# Altium schematic sheet Schematic.SchDoc
size A3
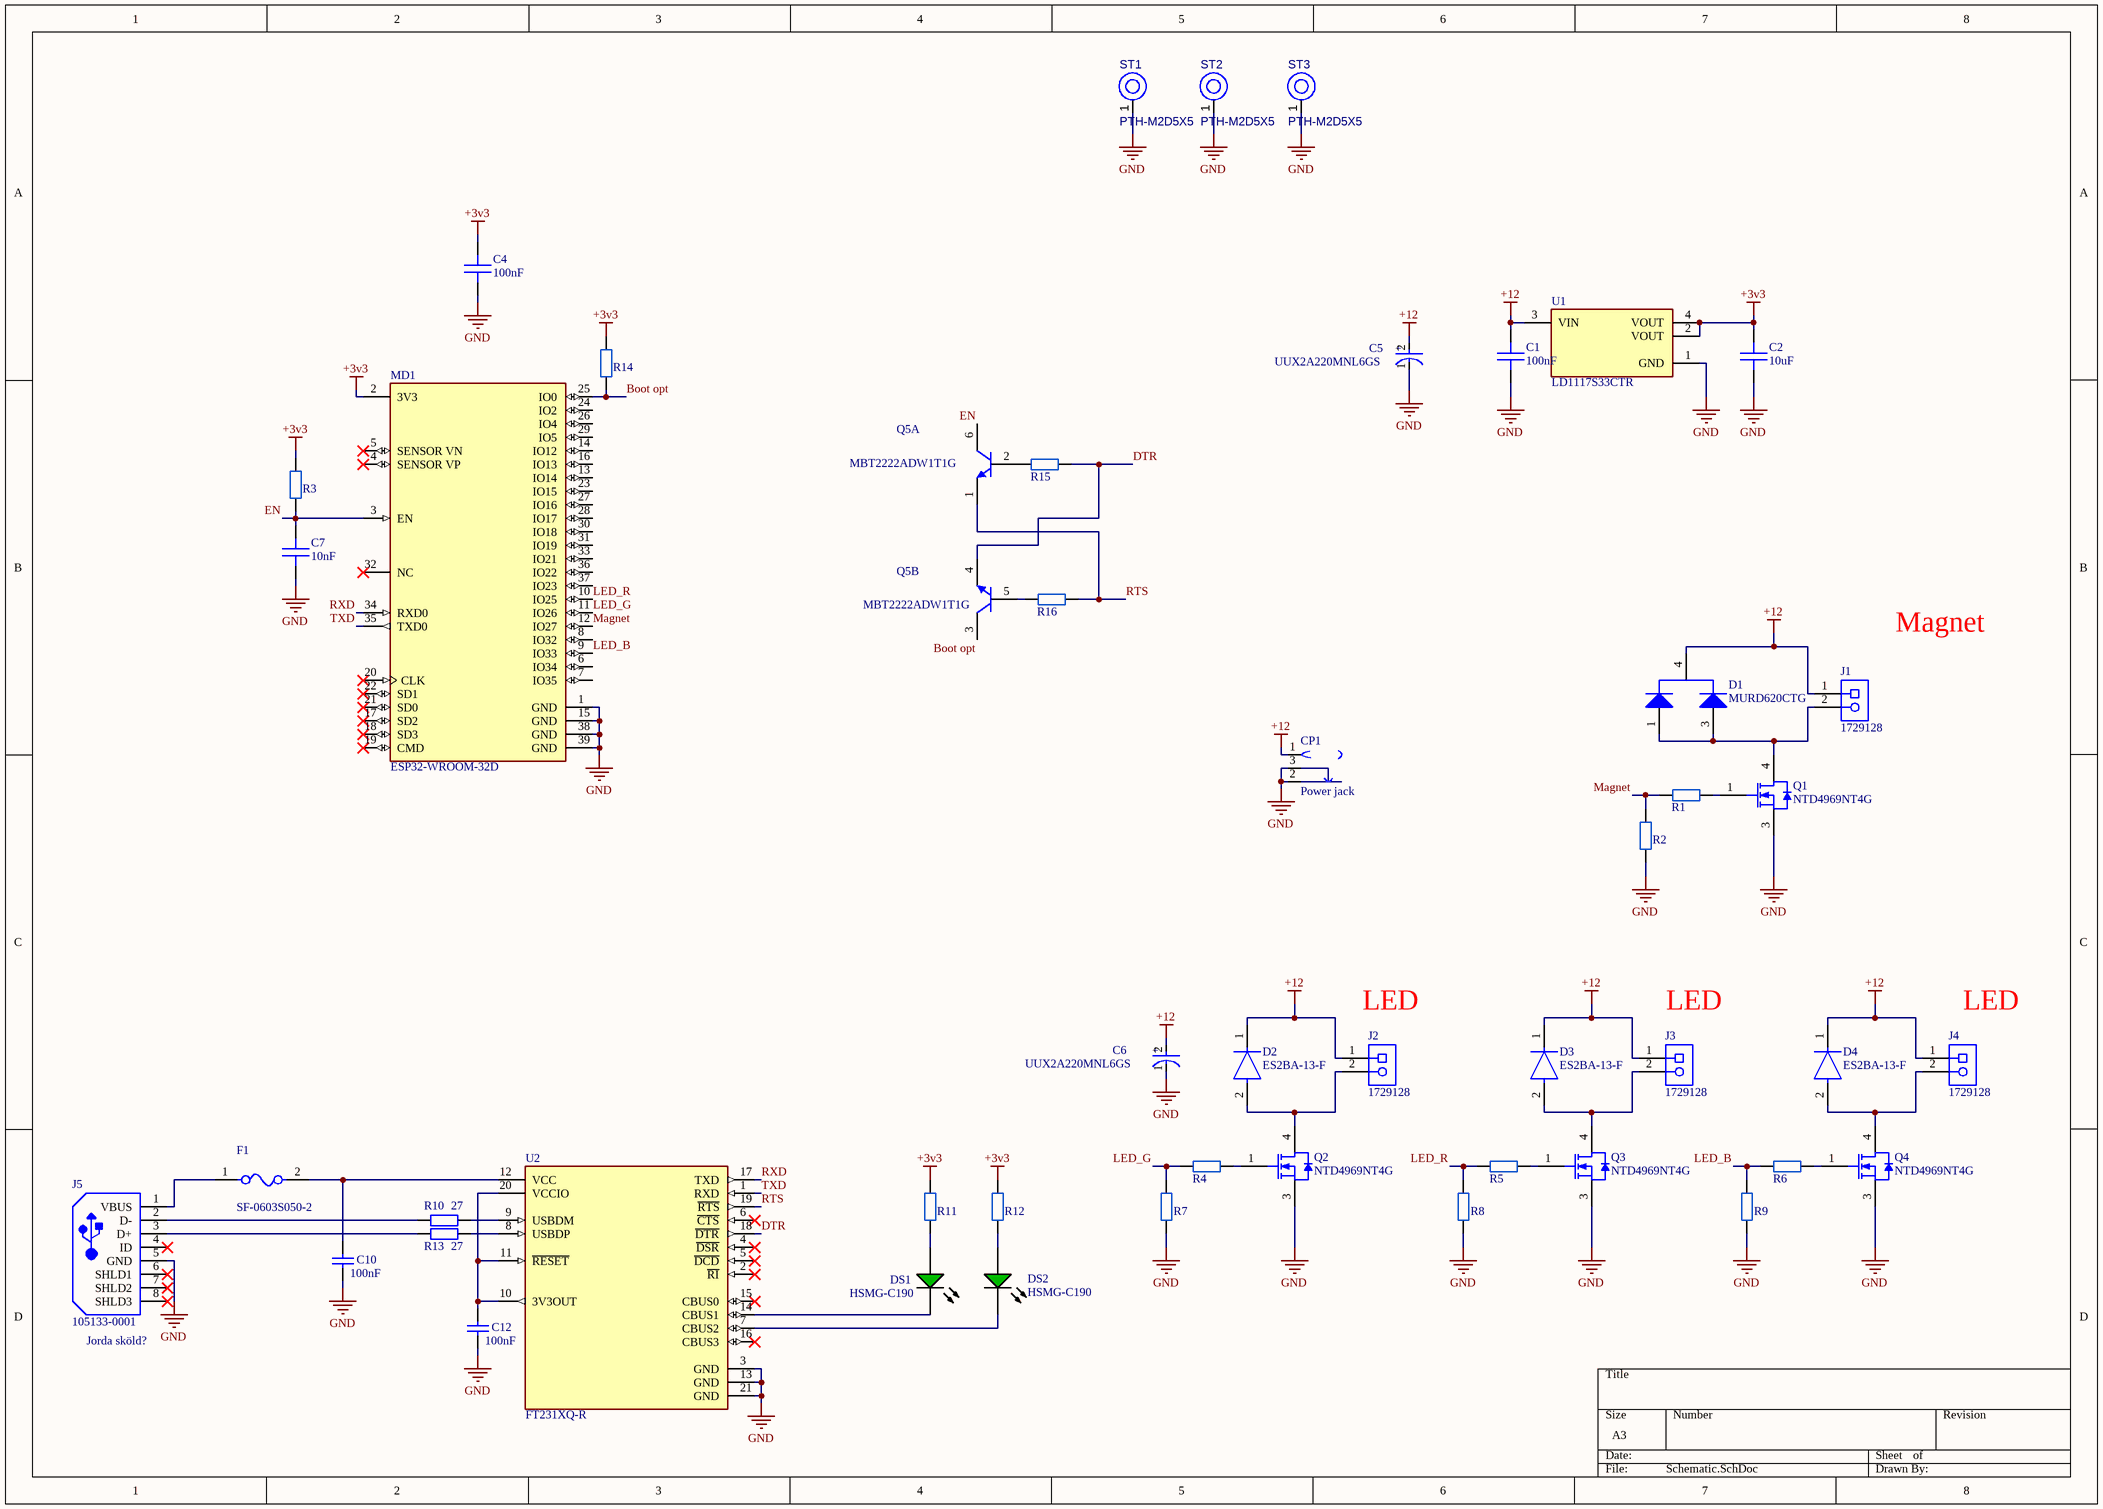
[diagram p0: Schematic.SchDoc]

## Parts
C1  value 100nF  [C0603 (1608)]  (hidden comment: Cap SMD)
C2  value 10uF  [C0603 (1608)]  (hidden comment: Cap SMD)
C4  value 100nF  [C0603 (1608)]  (hidden comment: Cap SMD)
C5  UUX2A220MNL6GS  [FP-UUX2A220MNL6GS-MFG]
C6  UUX2A220MNL6GS  [FP-UUX2A220MNL6GS-MFG]
C7  value 10nF  [C0603 (1608)]  (hidden comment: Cap SMD)
C10  100nF  [C0603 (1608)]
C12  100nF  [C0603 (1608)]
CP1  Power jack  [CLIFF SMD KLD-0202 BARRELL JACK DC CONNECTOR 2.1mm]
D1  MURD620CTG  [ONSC-DPAK-3-369C-01_V]
D2  ES2BA-13-F  [FP-SMA-MFG]
D3  ES2BA-13-F  [FP-SMA-MFG]
D4  ES2BA-13-F  [FP-SMA-MFG]
DS1  HSMG-C190  [AVAG-HSMX-C190_V]
DS2  HSMG-C190  [AVAG-HSMX-C190_V]
F1  SF-0603S050-2  [FP-SF-0603S-MFG]
J1  1729128  [PHOE-1729128-2_V]
J2  1729128  [PHOE-1729128-2_V]
J3  1729128  [PHOE-1729128-2_V]
J4  1729128  [PHOE-1729128-2_V]
J5  105133-0001  [MOLX-105133-0001_V]
MD1  ESP32-WROOM-32D  [FP-ESP32-WROOM-32D-MFG]
Q1  NTD4969NT4G  [ONSC-DPAK-3-369AA-01_V]
Q2  NTD4969NT4G  [ONSC-DPAK-3-369AA-01_V]
Q3  NTD4969NT4G  [ONSC-DPAK-3-369AA-01_V]
Q4  NTD4969NT4G  [ONSC-DPAK-3-369AA-01_V]
Q5  MBT2222ADW1T1G  [ONSC-SOT-363-6-419B-02_V]  (parts A,B of 2)
R1  Res  [R0603 (1608)]  (value not drawn)
R2  Res  [R0603 (1608)]  (value not drawn)
R3  Res  [R0603 (1608)]  (value not drawn)
R4  Res  [R0603 (1608)]  (value not drawn)
R5  Res  [R0603 (1608)]  (value not drawn)
R6  Res  [R0603 (1608)]  (value not drawn)
R7  Res  [R0603 (1608)]  (value not drawn)
R8  Res  [R0603 (1608)]  (value not drawn)
R9  Res  [R0603 (1608)]  (value not drawn)
R10  27  [R0603 (1608)]
R11  Res  [R0603 (1608)]  (value not drawn)
R12  Res  [R0603 (1608)]  (value not drawn)
R13  27  [R0603 (1608)]
R14  Res  [R0603 (1608)]  (value not drawn)
R15  Res  [R0603 (1608)]  (value not drawn)
R16  Res  [R0603 (1608)]  (value not drawn)
ST1  PTH-M2D5X5  [PTH-M2D5X5]
ST2  PTH-M2D5X5  [PTH-M2D5X5]
ST3  PTH-M2D5X5  [PTH-M2D5X5]
U1  LD1117S33CTR  [FP-SOT-223-0046067_14-MFG]
U2  FT231XQ-R  [FP-QFN-20-MFG]

## Nets
+3v3: C2.2 C4.2 MD1.2(3V3) R3.1 R11.2 R12.2 R14.1 U1.2(VOUT) U1.4(VOUT)
+12: C1.2 C5.2(A) C6.2(A) CP1.1 D1.4(K) D2.1(C) D3.1(C) D4.1(C) J1.1 J2.1 J3.1 J4.1 U1.3(VIN)
GND: C1.1 C2.1 C4.1 C5.1(C) C6.1(C) C7.1 C10.1 C12.1 CP1.2 CP1.3 J5.5(GND) MD1.1(GND) MD1.15(GND) MD1.38(GND) MD1.39(GND) Q1.3(S) Q2.3(S) Q3.3(S) Q4.3(S) R2.1 R7.1 R8.2 R9.1 ST1.1(H1) ST2.1(H1) ST3.1(H1) U1.1(GND) U2.3(GND) U2.13(GND) U2.21(GND)
Boot opt: MD1.25(IO0) Q5.3(C) R14.2
DTR: Q5.4(E) R15.2 U2.18(~{DTR})
EN: C7.2 MD1.3(EN) Q5.6(C) R3.2
LED_B: MD1.9(IO33) R6.2 R9.2
LED_G: MD1.11(IO26) R4.2 R7.2
LED_R: MD1.10(IO25) R5.2 R8.1
Magnet: MD1.12(IO27) R1.2 R2.2
RTS: Q5.1(E) R16.2 U2.19(~{RTS})
RXD: MD1.34(RXD0) U2.17(TXD)
TXD: MD1.35(TXD0) U2.1(RXD)
NetC10_2: C10.2 F1.2 U2.12(VCC)
NetC12_2: C12.2 U2.10(3V3OUT) U2.11(~{RESET}) U2.20(VCCIO)
NetD1_1: D1.1(A1) D1.3(A2) J1.2 Q1.4(D)
NetD2_2: D2.2(A) J2.2 Q2.4(D)
NetD3_2: D3.2(A) J3.2 Q3.4(D)
NetD4_2: D4.2(A) J4.2 Q4.4(D)
NetDS1_1: DS1.1(A) R11.1
NetDS1_2: DS1.2(K) U2.14(CBUS1)
NetDS2_1: DS2.1(A) R12.1
NetDS2_2: DS2.2(K) U2.7(CBUS2)
NetF1_1: F1.1 J5.1(VBUS)
NetJ5_2: J5.2(D-) R10.1
NetJ5_3: J5.3(D+) R13.1
NetQ1_1: Q1.1(G) R1.1
NetQ2_1: Q2.1(G) R4.1
NetQ3_1: Q3.1(G) R5.1
NetQ4_1: Q4.1(G) R6.1
NetQ5_2: Q5.2(B) R15.1
NetQ5_5: Q5.5(B) R16.1
NetR10_2: R10.2 U2.9(USBDM)
NetR13_2: R13.2 U2.8(USBDP)

Not connected (* = marked no-connect by the designer): J5 4(ID)* 6(SHLD1)* 7(SHLD2)* 8(SHLD3)*; MD1 4(SENSOR_VP)* 5(SENSOR_VN)* 6(IO34) 7(IO35) 8(IO32) 13(IO14) 14(IO12) 16(IO13) 17(SD2)* 18(SD3)* 19(CMD)* 20(CLK)* 21(SD0)* 22(SD1)* 23(IO15) 24(IO2) 26(IO4) 27(IO16) 28(IO17) 29(IO5) 30(IO18) 31(IO19) 32(NC)* 33(IO21) 36(IO22) 37(IO23); U2 2(~{RI})* 4(~{DSR})* 5(~{DCD})* 6(~{CTS})* 15(CBUS0)* 16(CBUS3)*

## Notes on the sheet
- Magnet
- (near J2) LED
- (near J3) LED
- (near J4) LED
- (near J5) Jorda sköld?
- (in symbol CMP-12462-000025-1) +

## Library data of the parts
C5 C6 = CMP-12462-000025-1: CAP ALUM 22UF 20% 100V SMD; Dissipation Factor: 0.08%; Life (Hours): 2000Hour; Ripple Current: 121mA; Leakage Current: 105uA; Diameter: 8mm; Height - Seated (Max): 0.413inch; Package Quantity: 1; Termination: SMD/SMT; Min Operating Temperature: -55°C; Lead Free: Lead Free; Tolerance: 20%; Case/Package: Radial; Packaging: Tape and Reel; Length: 10mm; Voltage Rating (DC): 100V; Features: General Purpose; Capacitance: 22uF; Lead Pitch: 3.1mm; Radiation Hardening: No; Max Operating Temperature: 105°C; Voltage Rating: 100V; Height: 10mm; Mount: Surface Mount
C10 C12 = Cap: Capacitor; Published: 8-Jun-2000; LatestRevisionDate: 17-Jul-2002; LatestRevisionNote: Re-released for DXP Platform.; PackageReference: RAD-0.3; Publisher: Altium Limited; PackageDescription: Radial Cap, Thru-Hole; 2 Leads; 0.3 in Pin Spacing; Value: 100nF
CP1 = Barrel jack KLD-0202: Surface mounted DC barrell jack, KLD-0202 design
D1 = CMP-0902-00255-1: SWITCHMODE(TM) Power Rectifier, 3-Pin DPAK, Pb-Free, Tube; Manufacturer: On Semiconductor; VRRM Max (V): 200; Type: Ultrafast; IFSM Max (A): 50; Packing: Tube; RoHS: TRUE; Mounting Technology: Surface Mount; DatasheetVersion: Rev. 11; PackageVersion: Rev. E, 02/2014; PackageDescription: 3-Pin Flange Mount, Body 6.54 x 6.095 mm, Pitch 2.29 mm; PartNumber: MURD620CTG; ComponentLink2URL: http://www.onsemi.cn/pub_link/Collateral/MURD620CT-D.PDF; PackageReference: DPAK-3-369C-01; ComponentLink1Description: Manufacturer URL; ComponentLink1URL: http://www.onsemi.com/; ComponentLink3Description: Package Specification; ComponentLink2Description: Datasheet; ComponentLink3URL: http://www.onsemi.cn/pub_link/Collateral/369C.PDF
D2-D4 = CMP-12791-000037-1: DIODE GEN PURP 100V 2A SMA; Manufacturer: Diodes Inc.; Standoff Height: 0.05mm; Value: 25pF; Peak Reverse Current: 5uA; Max Junction Temp: +150°C; Max Surge Forward Current: 50A; Digikey Description: DIODE GEN PURP 100V 2A SMA; Max Repetitive Reverse Voltage: 100V; Mouser Description: ES2BA Series 100 V 2 A Surface Mount Super-Fast Rectifier - DO-214AC; RoHS: TRUE; Device Class L3: Rectifier Diodes; Height: 2.4mm; Footprint Url: https://www.diodes.com/assets/Package-Files/SMA.pdf; Lead Free: Yes; Device Class L1: Discrete Semiconductors; Forward Current: 2A; ComponentLink2Description: Datasheet; Manufacturer Part Number: ES2BA-13-F; Temperature: -55°C to +150°C; Temperature Range Low: -55°C; Automotive: No; Device Class L2: Diodes; Category: Diode; Octopart: https://octopart.com/es2ba-13-f-diodes+inc.-14402013; Package: SMA; Capacitance: 25pF; ComponentLink2URL: https://www.diodes.com/assets/Datasheets/ds14002.pdf; Reverse Voltage: 100V; Temperature Range High: +150°C
DS1 DS2 = CMP-1744-00002-1: Chip LED, Green, 2.2 V, -40 to 85 degC, 2-Pin SMD, RoHS, Tape and Reel; Frequency: 400 KHz; Max Supply Voltage: 5.5 V; Access Time: 3500 ns; Clock Frequency: 100 KHz; Case\Package: SOIC; Density: 32 kb; Nominal Supply Current: 2 mA; Interface: Serial; Min Supply Voltage: 1.7 V; Packaging: Tape and Reel; PackageReference: HSMX-C190; ComponentLink2URL: http://docs.avagotech.com/docs/AV02-0551EN; RoHSCompliant: true; Pins: 8; REACH SVHC: No SVHC; Max Operating Temperature: 85 degC; Width: 4 mm; Radiation Hardening: No; Package Quantity: 3000; ComponentLink3Description: Package Specification; ComponentLink1Description: Manufacturer URL; Min Operating Temperature: -40 degC; PackageDescription: 2-Pin Surface Mount Device, Body 1.6 x 0.8 mm, Height 0.9 mm; Max Clock Frequency: 100 KHz; Height: 1.5 mm; ComponentLink1URL: http://www.avagotech.com/; DatasheetVersion: Mar-12; ComponentLink2Description: Datasheet; Mount: Surface Mount; Length: 5 mm; ComponentLink3URL: http://www.fairchildsemi.com/dwg/MA/MA03D.pdf
F1 = CMP-07399-000004-1: FUSE BOARD MNT 500MA 50VDC 0603; Manufacturer: Bourns Inc.; Fuse I2T: 0.009A2Sec; Fuse Current: 0.5A; Fuse Interrupt Ac Current: 50A; Max Fuse Ac Voltage: 35V; Resistance: 232mΩ; Fuse Blow Speed: Slow; Value: 232mΩ; Max Fuse Dc Voltage: 50V; Automotive: No; Category: Fuse; Temperature Range High: +105°C; Device Class L1: Circuit Protection; Height: 0.55mm; RoHS: TRUE; ComponentLink2URL: https://www.bourns.com/docs/product-datasheets/sf0603s.pdf; Ipc Land Pattern Name: CAPC16080X45; Temperature Range Low: -20°C; Mouser Description: Surface Mount Fuses 0.50A Slow Blow SinglFuse; Manufacturer Part Number: SF-0603S050-2; Package: SF-0603S; Device Class L3: unset; Digikey Description: FUSE BOARD MNT 500MA 50VDC 0603; Device Class L2: Fuses; Lead Free: Yes; Temperature: -20°C to +105°C; ComponentLink2Description: Datasheet; Octopart: https://octopart.com/sf-0603s050-2-bourns-10486821; Fuse Interrupt Dc Current: 50A
J1-J4 = CMP-2000-05815-1: PCB Terminal Block, 13.5 A, 400 V, 2-Pin THD, RoHS, Bulk; Manufacturer: Phoenix Contact; Package Version: 03/2015; No. of Rows: 1; Pitch: 5.08mm; No. of Positions: 2; Voltage Rating: 400V; Current Rating: 13500mA; Manufacturer URL: http://www.phoenixcontact.com/; Datasheet URL: https://datasheet.ciiva.com/16046/1729128-16046181.pdf; RoHS: TRUE; Package URL: https://www.phoenixcontact.com/online/portal/pi/pxc/product_detail_page/!ut/p/b1/3VdJjqNKFDxLH8AFycySyWY2ozFsEPOMMQaDOX1XedGL_1Vdm5YXJleknhSKeBkvI6EA8ncAo3AYoDhBQGco6KN7VURTdemj9us_IEKEZo_YHiPAEWEFmDGOHMORkqKYCORBZxgL7ZoaZYcbFFUZ3fqxSY6GOuxydWUuHqz1ynmMFygu583Bob0Ewr6Sd_l-5m-kAueHiB0jpRwZwe58wwtkpxtMYd_LmGcDRU02dRNEyWt6Y2ti5pSyJ_reIkzIulrqApdnbT11V5jnCKbYNCvhEM1MCpPByat_X379-iThf08CI5GfOPqfBeS3BRoBOdD55AKVv0iLwCMq-2BrzXWSGRH7pUGD9uwXQjiph3xL0DKQwdGa0JImiIOmBNOestqgwTHSSs2oOep-78apyXQBvNi8ZLaFjvjWvcaUEBu0MC6Wbe-d6mB0FAebo2lUWinqYaZs5DAYzV0RP9yitUjnGJ0iI9xhZkT42OCQNUJJhkgWINNQLP2JFP6OpMg3JCVg70jqHT0lvKOnhHf0lPuOnnLf0VPuWx6_dxwUIvwk5WMkT0kLL1mh61l2yZVSzG3pYV_bqo-mj6uMKwKwdnnW8Jh5RTOJzMOA5c-eJDaZQw4mTMPH02PvS_ZAqNVjVTo2WyYLkwH_KU1mmmG5kjRhDqPXLwwVHvVOjCM60-fpXvTDfMGW1PVFVS1r4e4yVDk4ZdNbkUHvqPqQSeian4UD39fNKmachqdJ1NJbyk8rXT9mXTvPk3oE5meulKGgiruPJek-4I9hTT6G8ZLOyRSm2RRVbThERQad5OS28hdt4YW4vG0stgYYzsWsK4_7y6DZMjJSCqri1kyiZR5vD7pwIrNR7QwPHTcLTI5qT7eRlpHrdGiupYlqQDJ7zy_CND8fWWBoLRXxk1RVcXiBQwbTD4Xi7KL-FuO94t9xaqweXzH; PartNumber: 1729128; Package Description: 2-Pin Through Hole Device, Body 8.1 x 10.16 mm, Pitch 5.08 mm; Datasheet Version: 12/2013; Mounting Technology: ThroughHole; Orientation: Horizontal; Package Reference: 1729128-2; Packing: Bulk
J5 = CMP-2000-05829-1: Micro-USB B Receptacle, Vertical, -30 to 85 degC, 5-Pin SMD, RoHS, Tape and Reel; Manufacturer: Molex; Package Version: Rev. C, 11/2015; Voltage Rating: 30VAC; Connector Type: MicroUSBTypeBReceptacle; Current Rating: 1.8A; Number of Ports: 1; Voltage - Max: 30V; Mounting Style: SMD/SMT; Packaging: Reel; Product: MicroUSBTypeBConnectors; Contact Plating: Gold; Flammability Rating: UL94V-0; Package Description: 5-Pin Surface Mount Device, Pitch 0.65 mm; Package Reference: 105133-0001; Contact Material: CopperAlloy; Mounting Angle: Vertical; RoHS: Details; Manufacturer URL: http://www.molex.com/; Factory Pack Quantity: 6000; PartNumber: 105133-0001; Standard: USB; Brand: Molex; Series: 105133; Product Category: USBConnectors; Termination Style: SolderTail; Gender: Receptacle; Package URL: http://www.molex.com/pdm_docs/sd/1051330001_sd.pdf; Datasheet Version: 03/2016; Color: Black; Datasheet URL: http://www.molex.com/webdocs/datasheets/pdf/en-us/1051330001_IO_CONNECTORS.pdf; Mounting Technology: SurfaceMount
MD1 = CMP-194065-000003-1: WIFI MODULE 32MBITS SPI FLASH; Manufacturer: Espressif Systems; Max Supply Voltage: 3.6V; Nominal Supply Current: 500mA; Max Frequency: 2484MHz; Number Of Adc Channels: 16; Number Of Gpio: 32; Interface: I2C,SPI,UART,Ethernet,I2S,Other; Data Rate: 150Mbits/s; Min Supply Voltage: 3V; Bandwidth: 72MHz; Sensitivity: -98dBm; Octopart: https://octopart.com/esp32-wroom-32d-espressif+systems-91040050; Package: ESP32-WROOM-32D; ComponentLink2URL: https://www.espressif.com/sites/default/files/documentation/esp32-wroom-32d_esp32-wroom-32u_datasheet_en.pdf; Lead Free: Yes; Category: UNK; Mouser Description: Wi-Fi/BT BLE Module ESP32-D0WD, SPI Flash, UART, P; Device Class L1: Integrated Circuits (ICs); RoHS: TRUE; Temperature Range Low: -40°C; ComponentLink2Description: Datasheet; Digikey Description: WIFI MODULE 32MBITS SPI FLASH; Height: 3.2mm; Temperature: -40°C to +85°C; Manufacturer Part Number: ESP32-WROOM-32D; Device Class L3: Transceivers; Device Class L2: RF Semiconductors and Devices; Temperature Range High: +85°C; Automotive: No
Q1-Q4 = CMP-1058-00344-1: Power MOSFET, 30 V, 41 A, Single N-Channel, 3-Pin DPAK, Pb-Free, Tape and Reel; Manufacturer: On Semiconductor; ID Max (A): 41; VGS(th) Max (V): 2.5; Qrr Typ (nC): 8; Ciss Typ (pF): 837; V(BR)DSS Min (V): 30; Coss Typ (pF): 347; VGS Max (V): 20; Crss Typ (pF): 180; Channel Polarity: N Channel; Packing: Tape and Reel; ComponentLink2URL: http://www.onsemi.cn/pub_link/Collateral/NTD4969N-D.PDF; ComponentLink3Description: Package Specification; ComponentLink1Description: Manufacturer URL; Configuration: Single; ComponentLink2Description: Datasheet; DatasheetVersion: Rev. 1; PartNumber: NTD4969NT4G; Mounting Technology: Surface Mount; ComponentLink3URL: http://www.onsemi.cn/pub_link/Collateral/369AA.PDF; PackageDescription: 3-Pin Flange Mount, Body 6.54 x 6.095 mm, Pitch 2.29 mm; Package Type: DPAK-3, IPAK-3; PackageReference: DPAK-3-369AA-01; PackageVersion: Rev. B, 06/2010; ComponentLink1URL: http://www.onsemi.com/; RoHS: Pb-Free
Q5 = CMP-1048-00839-1: General Purpose Transistor, NPN Silicon, 6-Pin SOT-363, Pb-Free, Tape and Reel; Manufacturer: On Semiconductor; Polarity: Dual NPN; fT Min (MHz): 300; IC Continuous (A): 0.6; PackageDescription: 6-Pin Small Outline Transistor, Body 2 x 1.25 mm, Pitch 0.65 mm; DatasheetVersion: Rev. 5; ComponentLink3URL: http://www.onsemi.cn/pub_link/Collateral/419B-02.PDF; RoHS: TRUE; ComponentLink2Description: Datasheet; ComponentLink3Description: Package Specification; ComponentLink2URL: http://www.onsemi.com/pub_link/Collateral/MBT2222ADW1T1-D.PDF; ComponentLink1URL: http://www.onsemi.com/; PartNumber: MBT2222ADW1T1G; Packing: Tape and Reel; Mounting Technology: Surface Mount; PackageReference: SOT-363-6-419B-02; ComponentLink1Description: Manufacturer URL; PackageVersion: Rev. Y, 12/2012
R1-R9 R11 R12 R14-R16 = Resistor EU
R10 R13 = Res2: Resistor; Published: 8-Jun-2000; LatestRevisionDate: 17-Jul-2002; LatestRevisionNote: Re-released for DXP Platform.; PackageReference: AXIAL-0.4; Publisher: Altium Limited; PackageDescription: Axial Device, Thru-Hole; 2 Leads; 0.4 in Pin Spacing; Value: 27
ST1-ST3 = CMP-00028-00004-1: M2 PTH (2.5mm), 5mm pad; Pins: 1
U1 = CMP-0244-00307-2: IC REG LINEAR 3.3V 800MA SOT223; Input Bias Current: 5mA; Output Voltage Accuracy: 1%; Dropout Voltage: 1.1V; Power Dissipation: 12W; Polarity: Positive; Min Input Voltage: 5.3V; Quiescent Current: 10mA; Max Output Current: 1.3A; Output Current: 950mA; Number of Regulators: 1; Max Supply Voltage: 15V; Output Type: Fixed; Output Voltage: 3.3V; Number of Terminals: 4; Min Supply Voltage: 3.3V; Termination: SMD/SMT; Mount: Surface Mount; Max Power Dissipation: 12W; Case/Package: SOT-223; Lead Free: Lead Free; Height: 1.8mm; REACH SVHC: No SVHC; Radiation Hardening: No; Width: 3.5mm; Length: 6.5mm; Packaging: Tape and Reel; Max Input Voltage: 15V; Accuracy: 1%; Weight: 0.01lb; Contact Plating: Tin; Max Operating Temperature: 125°C; Number of Pins: 4; Max Output Voltage: 3.3V; Min Operating Temperature: -40°C; Nominal Output Voltage: 3.3V; Package Quantity: 1; Min Output Voltage: 3.3V; Number of Outputs: 1
U2 = CMP-0248-00001-3: IC USB SERIAL FULL UART 20QFN; Data Rate: 12Mbps; Operating Supply Current: 8mA; Min Supply Voltage: 2.97V; Max Supply Voltage: 5.5V; Number of Channels: 1; Min Operating Temperature: -40°C; Case/Package: QFN; Mount: Surface Mount; Number of Pins: 20; Interface: UART; Lead Free: Lead Free; Package Quantity: 5000; Weight: 0.004339oz; Packaging: Tape and Reel; Max Operating Temperature: 85°C